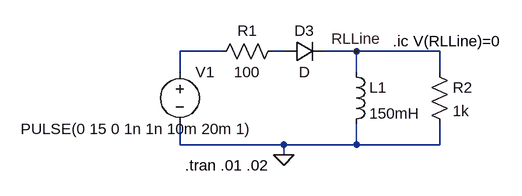
[diagram p0: schematic Carga bobina.asc]
Carga bobina.asc, the LTspice schematic file:
Version 4
SHEET 1 880 680
WIRE 112 128 48 128
WIRE 208 128 192 128
WIRE 320 128 272 128
WIRE 448 128 320 128
WIRE 48 160 48 128
WIRE 320 160 320 128
WIRE 448 160 448 128
WIRE 48 272 48 240
WIRE 208 272 48 272
WIRE 320 272 320 240
WIRE 320 272 208 272
WIRE 448 272 448 240
WIRE 448 272 320 272
WIRE 208 288 208 272
FLAG 208 288 0
FLAG 320 128 RLLine
SYMBOL res 96 144 R270
WINDOW 0 32 56 VTop 2
WINDOW 3 0 56 VBottom 2
SYMATTR InstName R1
SYMATTR Value 100
SYMBOL voltage 48 144 R0
WINDOW 3 -245 104 Left 2
WINDOW 123 0 0 Left 0
WINDOW 39 0 0 Left 0
SYMATTR Value PULSE(0 15 0 1n 1n 10m 20m 1)
SYMATTR InstName V1
SYMBOL ind 304 144 R0
SYMATTR InstName L1
SYMATTR Value 150mH
SYMATTR SpiceLine Ipk=2 Rser=0 Rpar=0 Cpar=0
SYMBOL res 432 144 R0
SYMATTR InstName R2
SYMATTR Value 1k
SYMBOL diode 208 144 R270
WINDOW 0 32 32 VTop 2
WINDOW 3 0 32 VBottom 2
SYMATTR InstName D3
TEXT 376 112 Left 2 !.ic V(RLLine)=0
TEXT 56 304 Left 2 !.tran .01 .02

The netlist it stands for:
* Carga bobina.asc
R1 N001 N002 100
V1 N001 0 PULSE(0 15 0 1n 1n 10m 20m 1)
L1 RLLine 0 150mH Ipk=2 Rser=0 Rpar=0 Cpar=0
R2 RLLine 0 1k
D3 N002 RLLine D
.model D D
.lib standard.dio
.ic V(RLLine)=0
.tran .01 .02
.backanno
.end